# EAGLE design SatNOGS_PSUV1 (EAGLE 6.4)
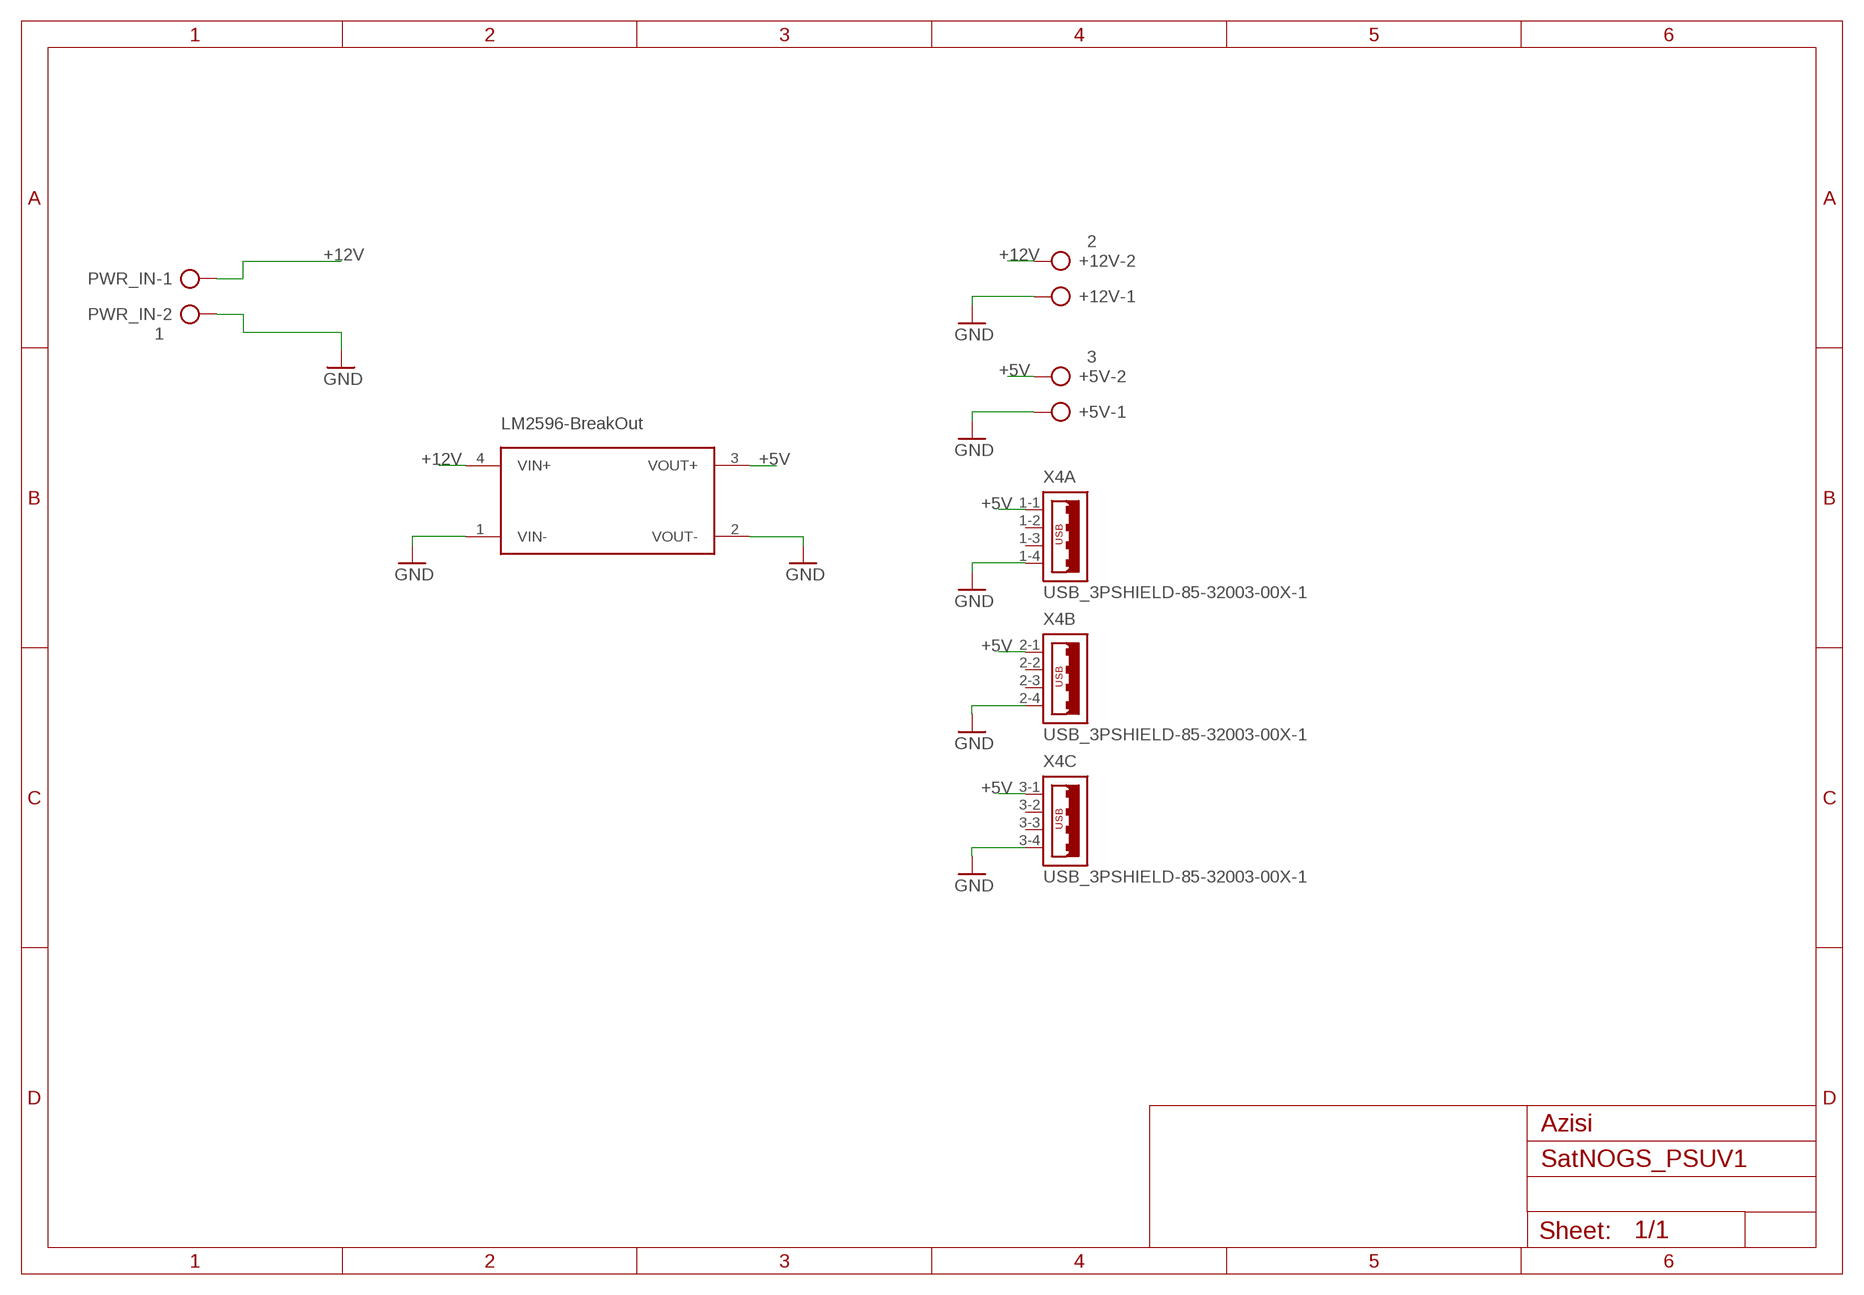
[diagram p0: schematic, sheet 1]

## Parts
+5V  3  AK500/2  [AK500/2]
+12V  2  AK500/2  [AK500/2]
PWR_IN  1  AK500/2  [AK500/2]
U$1  LM2596-BREAKOUTLM2596-BREAKOUT  [LM2596-BREAKOUT]
X4  USB_3PSHIELD-85-32003-00X-1  [85-32003-00X-1]

## Nets
+5V: +5V.2 U$1.3(VOUT+) X4.1-1 X4.2-1 X4.3-1
+12V: +12V.2 PWR_IN.1 U$1.4(VIN+)
GND: +5V.1 +12V.1 PWR_IN.2 U$1.1(VIN-) U$1.2(VOUT-) X4.1-4 X4.2-4 X4.3-4
Unconnected: X4.1-2 X4.1-3 X4.2-2 X4.2-3 X4.3-2 X4.3-3 X4.M1(S:S1) X4.M2(S:S2) X4.M3(S:S3) X4.M4(S:S4)

## Notes on the sheet
- Azisi

## Library data of the parts
+5V +12V PWR_IN = con-ptr500:AK500/2: CONNECTOR; OC_FARNELL: unknown; OC_NEWARK: unknown
U$1 = LM2596-Breakout:LM2596-BREAKOUT: Break out for LM2596 Switching power supply (regulated)
X4 = con-cypressindustries:USB_3PSHIELD-: Triple USB Connector Source: www.cypressindustries.com; OC_FARNELL: unknown; OC_NEWARK: unknown

## Board
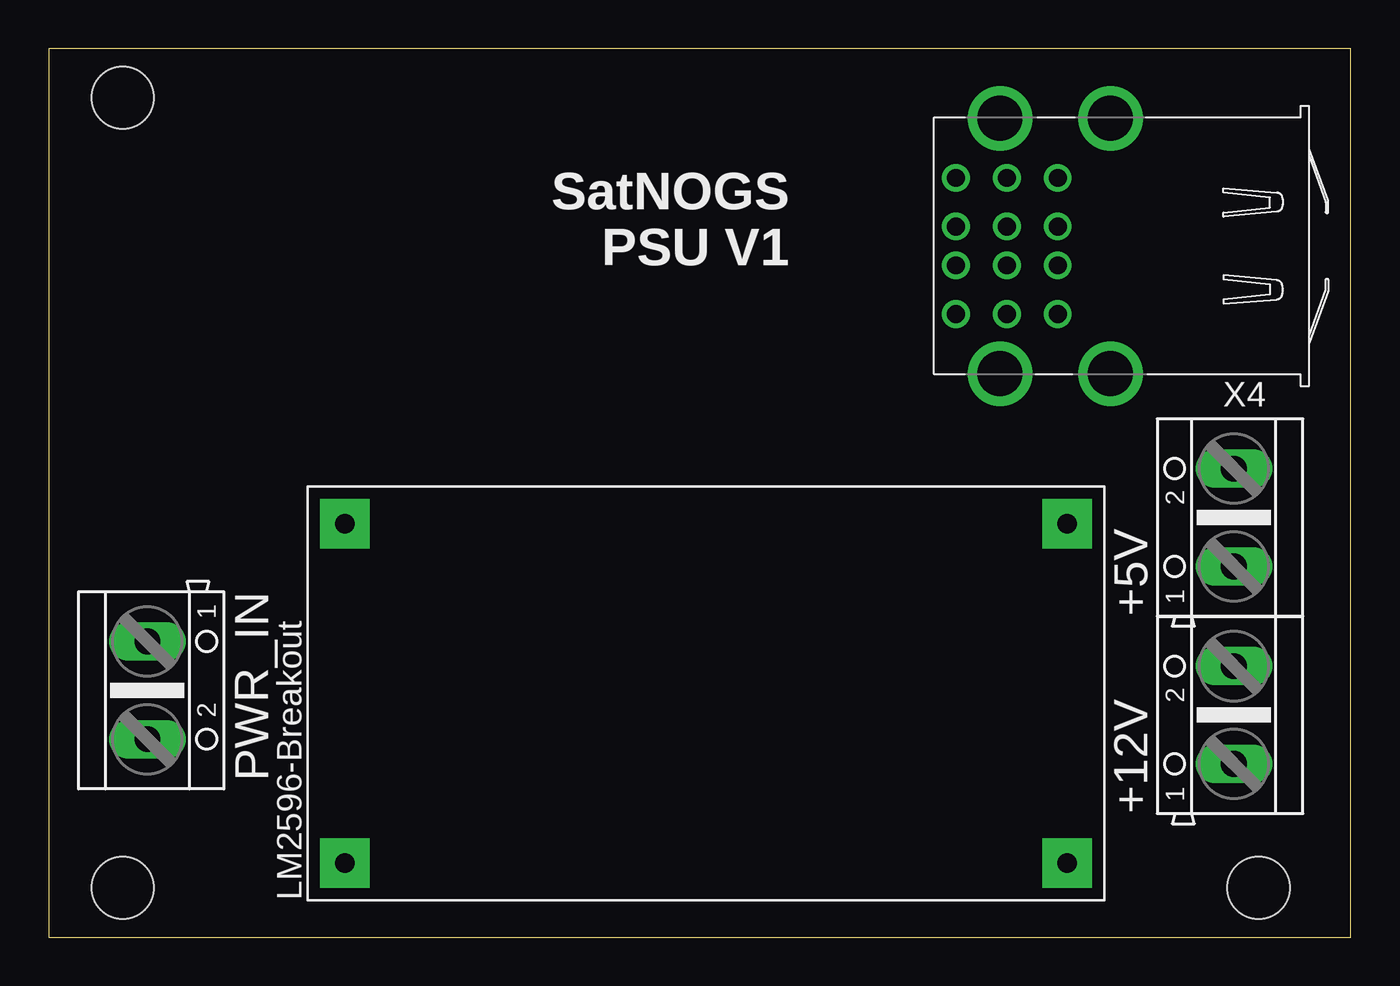
[diagram p1: board, top side]
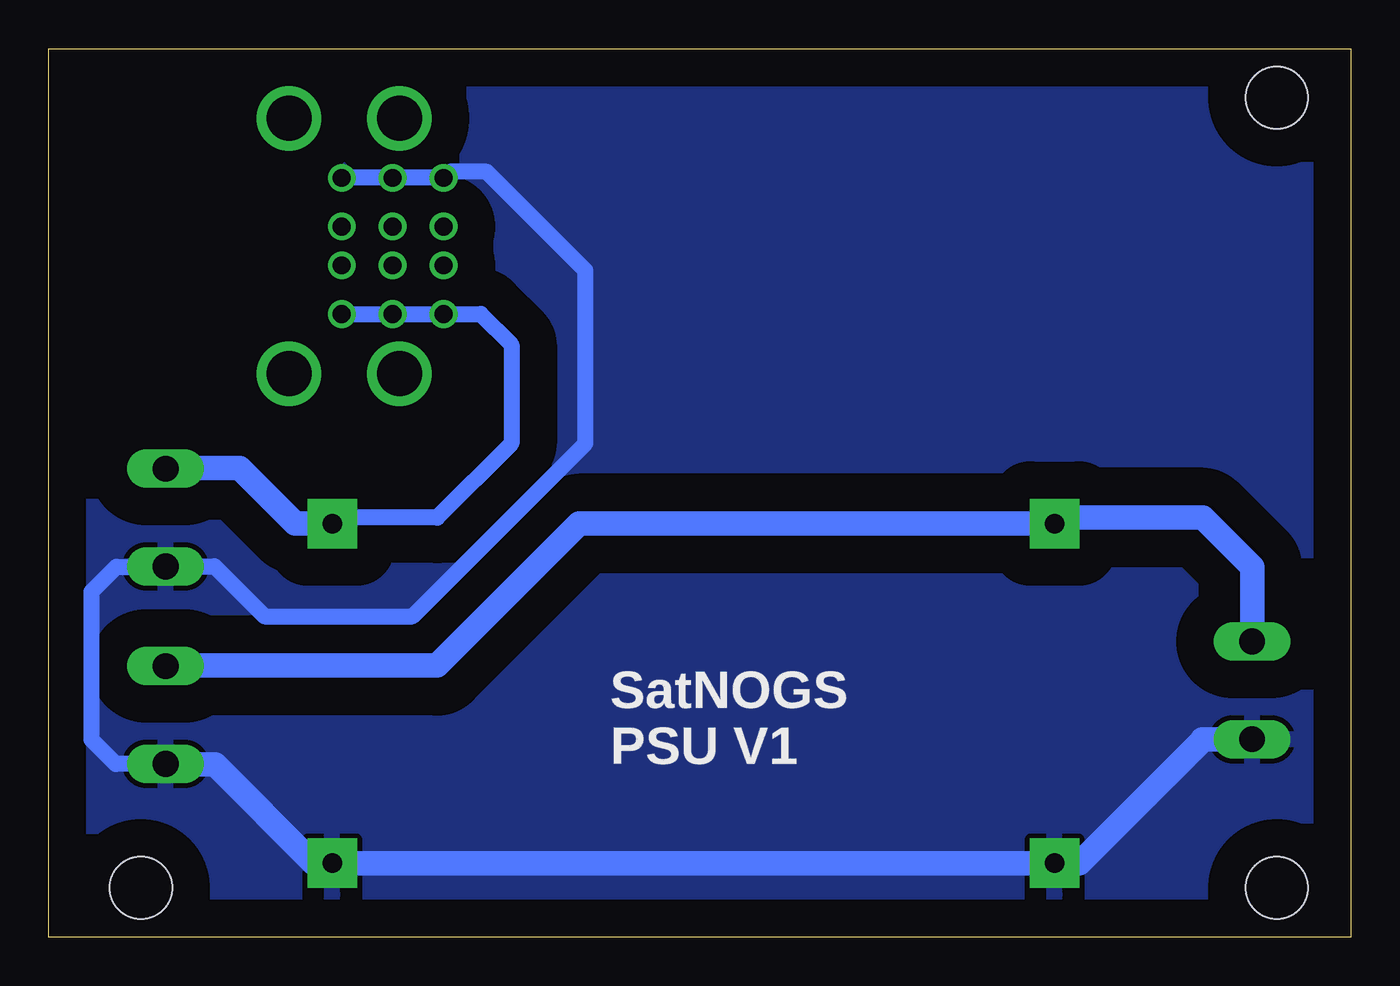
[diagram p2: board, bottom side, seen from below]

Size 66.98 x 45.71 mm. Coordinates in mm from the lower left corner, seen from the top.
Outline: 0,0 66.98,0 66.98,45.71 0,45.71 0,0
Copper layers (1*16): Top 0.035mm / dielectric 1.5mm / Bottom 0.035mm
Design rules "default": minimum track width 10mil, minimum drill 24mil, track to track 8mil, track to pad 8mil, pad to pad 8mil, via to via 8mil, smd to smd 8mil, copper to edge 40mil, drill to drill 8mil, minimum pad ring 10mil, minimum via ring 8mil, stop-mask expansion 4mil, vias tented up to drill 0mil, thermal gap 10mil
Holes 3.2 mm at 3.81,2.54 62.23,2.54 3.81,43.18

### Footprints (pad centres in the part's own frame; a part is rotated, then mirrored left to right if it is on the bottom)
AK500/2 = drill 1.321 long: 1 -2.515,0; 2 2.515,0
LM2596-BREAKOUT = drill 1 pad 2.54 square: 1 -8.89,17.78; 2 -8.89,-19.367; 3 8.572,-19.367; 4 8.572,17.78
85-32003-00X-1 = drill 0.92 pad 1.27: 1-1 2.71,3.5; 1-2 2.71,1; 1-3 2.71,-1; 1-4 2.71,-3.5; 2-1 5.33,3.5; 2-2 5.33,1; 2-3 5.33,-1; 2-4 5.33,-3.5; 3-1 7.95,3.5; 3-2 7.95,1; 3-3 7.95,-1; 3-4 7.95,-3.5 | drill 2.3 pad 3: M1 0,6.57; M2 0,-6.57; M3 5.68,6.57; M4 5.68,-6.57

### Placement (x,y rotation side)
+5V  60.96,21.59 90 top
+12V  60.96,11.43 90 top
PWR_IN  5.08,12.7 270 top
U$1  33.02,12.7 90 top
X4  54.61,35.56 180 top

### Tracks (layer width: path | path; a pad name or v marks a point on that pad's centre or on a via)
+5V
  Bottom 0.813: X4.1-1 X4.2-1 | X4.2-1 X4.3-1 | X4.2-1 44.76,32.06 43.18,30.48 43.18,25.4 46.99,21.59 52.07,21.59 U$1.3
  Bottom 1.27: U$1.3 54.29,21.27 57.15,24.13 62.2,24.13 +5V.2
+12V
  Bottom 1.27: +12V.2 62.23,13.97 46.99,13.97 39.69,21.27 U$1.4 14.92,21.59 7.62,21.59 5.08,19.05 PWR_IN.1
GND
  Bottom 0.813: X4.1-4 X4.2-4 X4.3-4 46.35,39.37 44.45,39.37 39.37,34.29 39.37,25.4 48.26,16.51 55.88,16.51 58.45,19.07 +5V.1 62.26,19.05 63.5,19.05 64.77,17.78 64.77,10.16 63.52,8.91 +12V.1
  Bottom 1.27: 7.64,10.19 PWR_IN.2 7.59,10.19 13.97,3.81 U$1.1 U$1.2 53.34,3.81 58.42,8.89 62.2,8.89 +12V.1
  pour Bottom (isolate 1.93): 0,0 0,45.72 67.31,45.72 67.31,0

### Text on the board
tPlace: SatNOGS / PSU V1
bPlace: SatNOGS / PSU V1